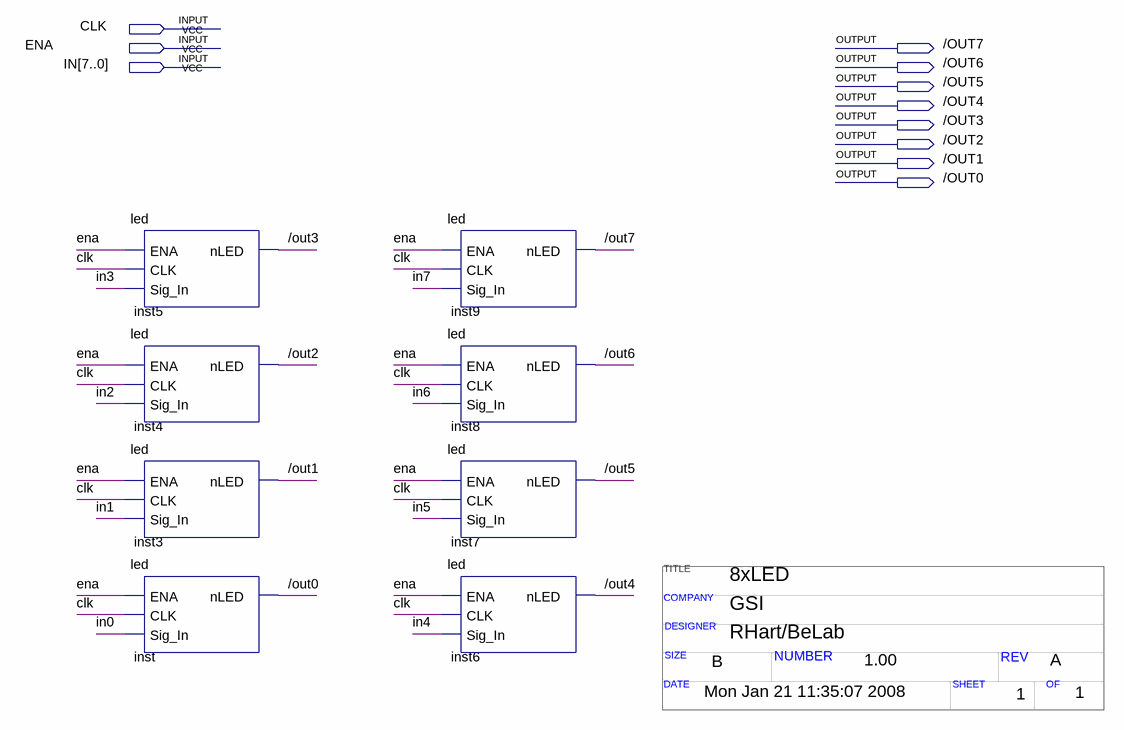
[diagram p0: schematic sheet]
// Quartus schematic 8xled.bdf as structural Verilog: 8 symbols, 11 pins
// Title block: TITLE: 8xLED; COMPANY: GSI; DESIGNER: RHart/BeLab; SIZE: B; NUMBER: 1.00; REV: A; DATE: Mon Jan 21 11:35:07 2008; SHEET: 1; OF: 1
module \8xled  (
  input  CLK,
  input  ENA,
  input  [7:0] IN,
  output \/OUT7 ,
  output \/OUT6 ,
  output \/OUT5 ,
  output \/OUT4 ,
  output \/OUT3 ,
  output \/OUT2 ,
  output \/OUT1 ,
  output \/OUT0 
);

  led inst5 (.ENA(ENA), .CLK(CLK), .Sig_In(IN[3]), .nLED(\/OUT3 ));
  led inst4 (.ENA(ENA), .CLK(CLK), .Sig_In(IN[2]), .nLED(\/OUT2 ));
  led inst3 (.ENA(ENA), .CLK(CLK), .Sig_In(IN[1]), .nLED(\/OUT1 ));
  led inst (.ENA(ENA), .CLK(CLK), .Sig_In(IN[0]), .nLED(\/OUT0 ));
  led inst9 (.ENA(ENA), .CLK(CLK), .Sig_In(IN[7]), .nLED(\/OUT7 ));
  led inst8 (.ENA(ENA), .CLK(CLK), .Sig_In(IN[6]), .nLED(\/OUT6 ));
  led inst7 (.ENA(ENA), .CLK(CLK), .Sig_In(IN[5]), .nLED(\/OUT5 ));
  led inst6 (.ENA(ENA), .CLK(CLK), .Sig_In(IN[4]), .nLED(\/OUT4 ));
endmodule
